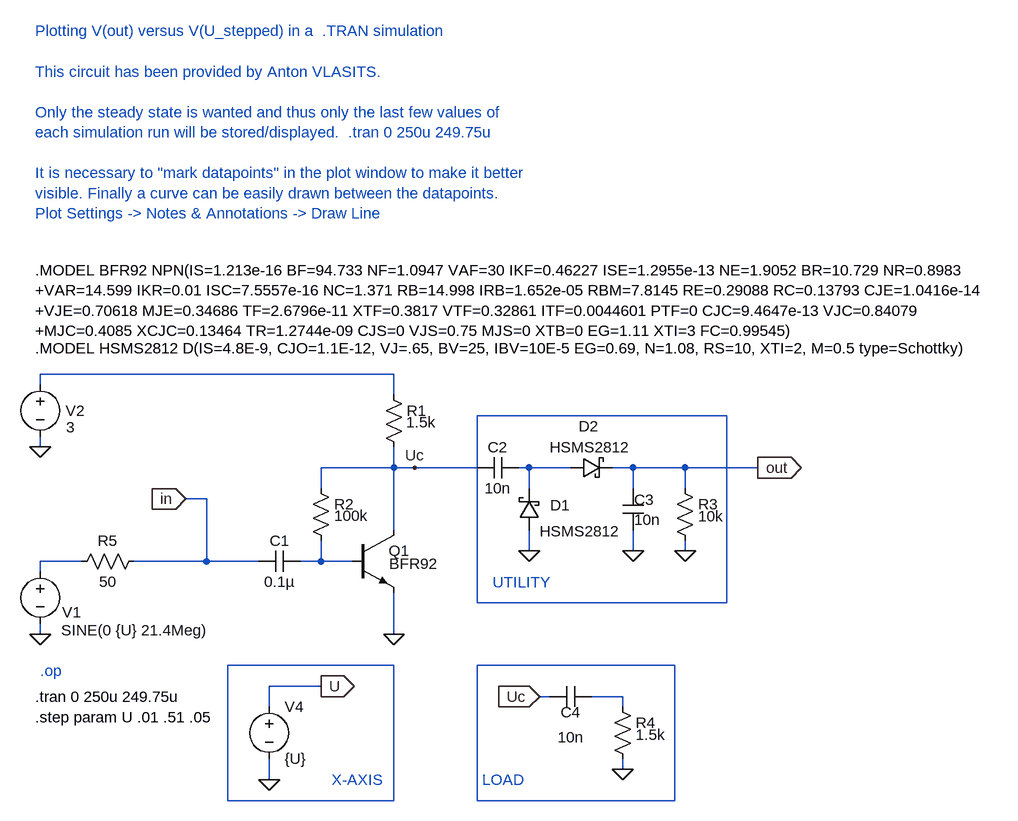
[diagram p0: schematic limiter1.asc]
limiter1.asc, the LTspice schematic file:
Version 4
SHEET 1 6000 772
WIRE 448 160 448 192
WIRE 448 80 448 48
WIRE 448 48 -96 48
WIRE -96 48 -96 64
WIRE 448 384 448 448
WIRE 304 336 336 336
WIRE 336 304 336 336
WIRE 336 336 384 336
WIRE 336 224 336 192
WIRE 240 336 160 336
WIRE -96 336 -96 352
WIRE -96 144 -96 160
WIRE -96 432 -96 448
WIRE 448 192 480 192
WIRE 448 192 448 288
WIRE 640 192 656 192
WIRE 656 192 656 224
WIRE 656 192 720 192
WIRE 656 288 656 320
WIRE 784 192 816 192
WIRE 816 192 816 224
WIRE 896 304 896 320
WIRE 896 224 896 192
WIRE 896 192 816 192
WIRE 896 192 1008 192
WIRE 816 288 816 320
WIRE 480 192 576 192
WIRE 800 560 800 544
WIRE 800 544 752 544
WIRE 800 640 800 656
WIRE 688 544 672 544
WIRE 160 336 160 240
WIRE 160 240 128 240
WIRE 256 640 256 672
WIRE 256 560 256 528
WIRE 256 528 336 528
WIRE 160 336 48 336
WIRE -32 336 -96 336
WIRE 448 192 336 192
FLAG -96 160 0
FLAG -96 448 0
FLAG 448 448 0
FLAG 656 320 0
FLAG 816 320 0
FLAG 896 320 0
FLAG 1008 192 out
IOPIN 1008 192 Out
FLAG 480 192 Uc
FLAG 800 656 0
FLAG 672 544 Uc
IOPIN 672 544 In
FLAG 128 240 in
IOPIN 128 240 In
FLAG 256 672 0
FLAG 336 528 U
IOPIN 336 528 Out
SYMBOL voltage -96 336 R0
WINDOW 0 34 78 Left 0
WINDOW 3 32 106 Left 0
WINDOW 39 0 0 Left 0
SYMATTR InstName V1
SYMATTR Value SINE(0 {U} 21.4Meg)
SYMATTR Value2 AC 0
SYMBOL npn 384 288 R0
WINDOW 3 57 52 Left 0
SYMATTR Value BFR92
SYMATTR InstName Q1
SYMBOL voltage -96 48 R0
WINDOW 0 39 56 Left 0
WINDOW 3 40 82 Left 0
WINDOW 123 0 0 Left 0
WINDOW 39 0 0 Left 0
SYMATTR InstName V2
SYMATTR Value 3
SYMBOL cap 240 352 R270
WINDOW 0 32 32 VTop 0
WINDOW 3 0 32 VBottom 0
SYMATTR InstName C1
SYMATTR Value 0.1µ
SYMBOL res 320 208 R0
WINDOW 3 36 58 Left 0
SYMATTR Value 100k
SYMATTR InstName R2
SYMBOL res 432 64 R0
WINDOW 3 35 58 Left 0
SYMATTR Value 1.5k
SYMATTR InstName R1
SYMBOL cap 640 176 R90
WINDOW 0 0 32 VBottom 0
WINDOW 3 32 32 VTop 0
SYMATTR InstName C2
SYMATTR Value 10n
SYMBOL schottky 672 288 R180
WINDOW 0 -47 38 Left 0
WINDOW 3 -123 -2 Left 0
SYMATTR InstName D1
SYMATTR Value HSMS2812
SYMATTR Description Diode
SYMATTR Type diode
SYMBOL schottky 720 208 R270
WINDOW 0 64 28 VTop 0
WINDOW 3 63 29 VBottom 0
SYMATTR InstName D2
SYMATTR Value HSMS2812
SYMATTR Description Diode
SYMATTR Type diode
SYMBOL cap 800 224 R0
WINDOW 0 18 17 Left 0
WINDOW 3 18 48 Left 0
SYMATTR InstName C3
SYMATTR Value 10n
SYMBOL res 880 208 R0
WINDOW 3 36 59 Left 0
SYMATTR Value 10k
SYMATTR InstName R3
SYMBOL cap 752 528 R90
WINDOW 0 56 32 VBottom 0
WINDOW 3 63 32 VTop 0
SYMATTR InstName C4
SYMATTR Value 10n
SYMBOL res 784 544 R0
WINDOW 3 36 59 Left 0
SYMATTR Value 1.5k
SYMATTR InstName R4
SYMBOL voltage 256 544 R0
WINDOW 123 0 0 Left 0
WINDOW 39 0 0 Left 0
SYMATTR InstName V4
SYMATTR Value {U}
SYMBOL res -48 352 R270
WINDOW 0 32 56 VTop 0
WINDOW 3 0 56 VBottom 0
SYMATTR InstName R5
SYMATTR Value 50
TEXT -104 544 Left 0 !.tran 0 250u 249.75u
TEXT -104 576 Left 0 !.step param U .01 .51 .05
TEXT -96 504 Left 0 ;.op
TEXT -104 -112 Left 0 !.MODEL BFR92 NPN(IS=1.213e-16 BF=94.733 NF=1.0947 VAF=30 IKF=0.46227 ISE=1.2955e-13 NE=1.9052 BR=10.729 NR=0.8983 \n+VAR=14.599 IKR=0.01 ISC=7.5557e-16 NC=1.371 RB=14.998 IRB=1.652e-05 RBM=7.8145 RE=0.29088 RC=0.13793 CJE=1.0416e-14\n+VJE=0.70618 MJE=0.34686 TF=2.6796e-11 XTF=0.3817 VTF=0.32861 ITF=0.0044601 PTF=0 CJC=9.4647e-13 VJC=0.84079 \n+MJC=0.4085 XCJC=0.13464 TR=1.2744e-09 CJS=0 VJS=0.75 MJS=0 XTB=0 EG=1.11 XTI=3 FC=0.99545)
TEXT -104 8 Left 0 !.MODEL HSMS2812 D(IS=4.8E-9, CJO=1.1E-12, VJ=.65, BV=25, IBV=10E-5 EG=0.69, N=1.08, RS=10, XTI=2, M=0.5 type=Schottky)
TEXT 584 672 Left 0 ;LOAD
TEXT 600 368 Left 0 ;UTILITY
TEXT -104 -480 Left 0 ;Plotting V(out) versus V(U_stepped) in a  .TRAN simulation\n \nThis circuit has been provided by Anton VLASITS.\n \nOnly the steady state is wanted and thus only the last few values of \neach simulation run will be stored/displayed.  .tran 0 250u 249.75u\n \nIt is necessary to "mark datapoints" in the plot window to make it better\nvisible. Finally a curve can be easily drawn between the datapoints.\nPlot Settings -> Notes & Annotations -> Draw Line
TEXT 352 672 Left 0 ;X-AXIS
RECTANGLE Normal 960 400 576 112
RECTANGLE Normal 880 704 576 496
RECTANGLE Normal 448 704 192 496

The netlist it stands for:
* limiter1.asc
V1 N003 0 SINE(0 {U} 21.4Meg) AC 0
Q1 Uc N002 0 0 BFR92
V2 N001 0 3
C1 in N002 0.1µ
R2 Uc N002 100k
R1 N001 Uc 1.5k
C2 N004 Uc 10n
D1 0 N004 HSMS2812
D2 N004 out HSMS2812
C3 out 0 10n
R3 out 0 10k
C4 N005 Uc 10n
R4 N005 0 1.5k
V4 U 0 {U}
R5 N003 in 50
.model D D
.lib standard.dio
.model NPN NPN
.model PNP PNP
.lib standard.bjt
.tran 0 250u 249.75u
.step param U .01 .51 .05
* .op
.MODEL BFR92 NPN(IS=1.213e-16 BF=94.733 NF=1.0947 VAF=30 IKF=0.46227 ISE=1.2955e-13 NE=1.9052 BR=10.729 NR=0.8983
+VAR=14.599 IKR=0.01 ISC=7.5557e-16 NC=1.371 RB=14.998 IRB=1.652e-05 RBM=7.8145 RE=0.29088 RC=0.13793 CJE=1.0416e-14
+VJE=0.70618 MJE=0.34686 TF=2.6796e-11 XTF=0.3817 VTF=0.32861 ITF=0.0044601 PTF=0 CJC=9.4647e-13 VJC=0.84079
+MJC=0.4085 XCJC=0.13464 TR=1.2744e-09 CJS=0 VJS=0.75 MJS=0 XTB=0 EG=1.11 XTI=3 FC=0.99545)
.MODEL HSMS2812 D(IS=4.8E-9, CJO=1.1E-12, VJ=.65, BV=25, IBV=10E-5 EG=0.69, N=1.08, RS=10, XTI=2, M=0.5 type=Schottky)
* LOAD
* UTILITY
* Plotting V(out) versus V(U_stepped) in a  .TRAN simulation
* This circuit has been provided by Anton VLASITS.
* Only the steady state is wanted and thus only the last few values of
* each simulation run will be stored/displayed.  .tran 0 250u 249.75u
* It is necessary to "mark datapoints" in the plot window to make it better
* visible. Finally a curve can be easily drawn between the datapoints.
* Plot Settings -> Notes & Annotations -> Draw Line
* X-AXIS
.backanno
.end